# Altium schematic sheet RS485.SchDoc
size A4
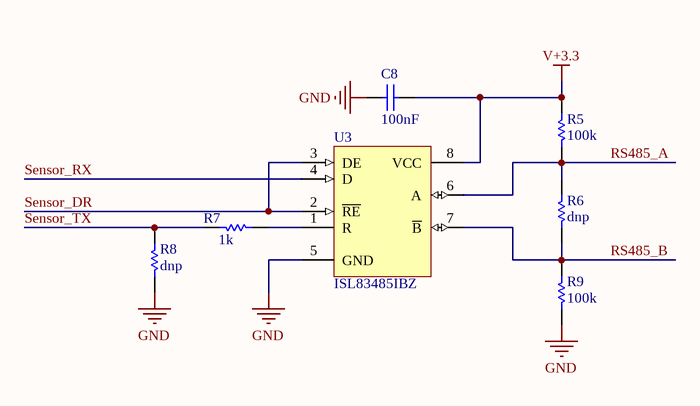
[diagram p0: RS485.SchDoc]

## Parts
C8  100nF  [0603]
R5  100k  [0603]
R6  dnp  [0603]
R7  1k  [0603]
R8  dnp  [0603]
R9  100k  [0603]
U3  ISL83485IBZ  [SO8]

## Nets
GND: C8.2 R8.1 R9.2 U3.5(GND)
V+3.3: C8.1 R5.1 U3.8(VCC)
RS485_A: R5.2 R6.1 U3.6(A)
RS485_B: R6.2 R9.1 U3.7(~{B})
Sensor_DR: U3.2(~{RE}) U3.3(DE)
Sensor_RX: U3.4(D)
Sensor_TX: R7.1 R8.2
NetR7_2: R7.2 U3.1(R)

## Library data of the parts
C8 = Cap Semi: Capacitor (Semiconductor SIM Model); Published: 8-Jun-2000; LatestRevisionDate: 29-May-2009; LatestRevisionNote: IPC-7351 Footprint Added.; PackageReference: C1206; Publisher: Altium Limited; PackageDescription: Chip Capacitor; Value: 100nF
R5 R6 R9 = Res Semi: Semiconductor Resistor; Value: 4K7; Published: 8-Jun-2000; LatestRevisionDate: 17-Jul-2002; LatestRevisionNote: Re-released for DXP Platform.; PackageReference: AXIAL-0.5; Publisher: Altium Limited
R7 R8 = Res Semi: Semiconductor Resistor; Value: 1M; Published: 8-Jun-2000; LatestRevisionDate: 17-Jul-2002; LatestRevisionNote: Re-released for DXP Platform.; PackageReference: AXIAL-0.5; Publisher: Altium Limited
U3 = SN75176AD: Differential Bus Transceiver; Note: Receiver Hysteresis of 50mV Typical; Published: 15-May-2002; LatestRevisionDate: 13-Apr-2006; LatestRevisionNote: IPC-7351 Footprint Added.; DatasheetVersion: Aug-1989; PackageVersion: Jan-1998; PackageReference: D008; Publisher: Altium Limited; PackageDescription: 8-Pin Small Outline Integrated Circuit 1.27 mm Pitch; Code_IPC: SOIC127P600-8; ComponentLink1Description: Manufacturer Link; ComponentLink1URL: http://www.ti.com/; ComponentLink2Description: Datasheet; ComponentLink2URL: http://www-s.ti.com/sc/ds/sn75176a.pdf